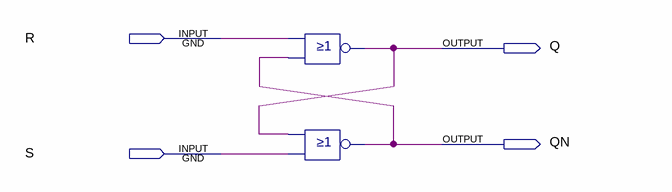
[diagram p0: schematic sheet]
// Quartus schematic RS_FF.bdf as structural Verilog: 2 symbols, 4 pins
module RS_FF (
  input  R,
  input  S,
  output Q,
  output QN
);

  nor inst (Q, R, QN);
  nor inst2 (QN, Q, S);
endmodule
